# EAGLE design lb_uno_v1.3 (EAGLE 9.6.2)
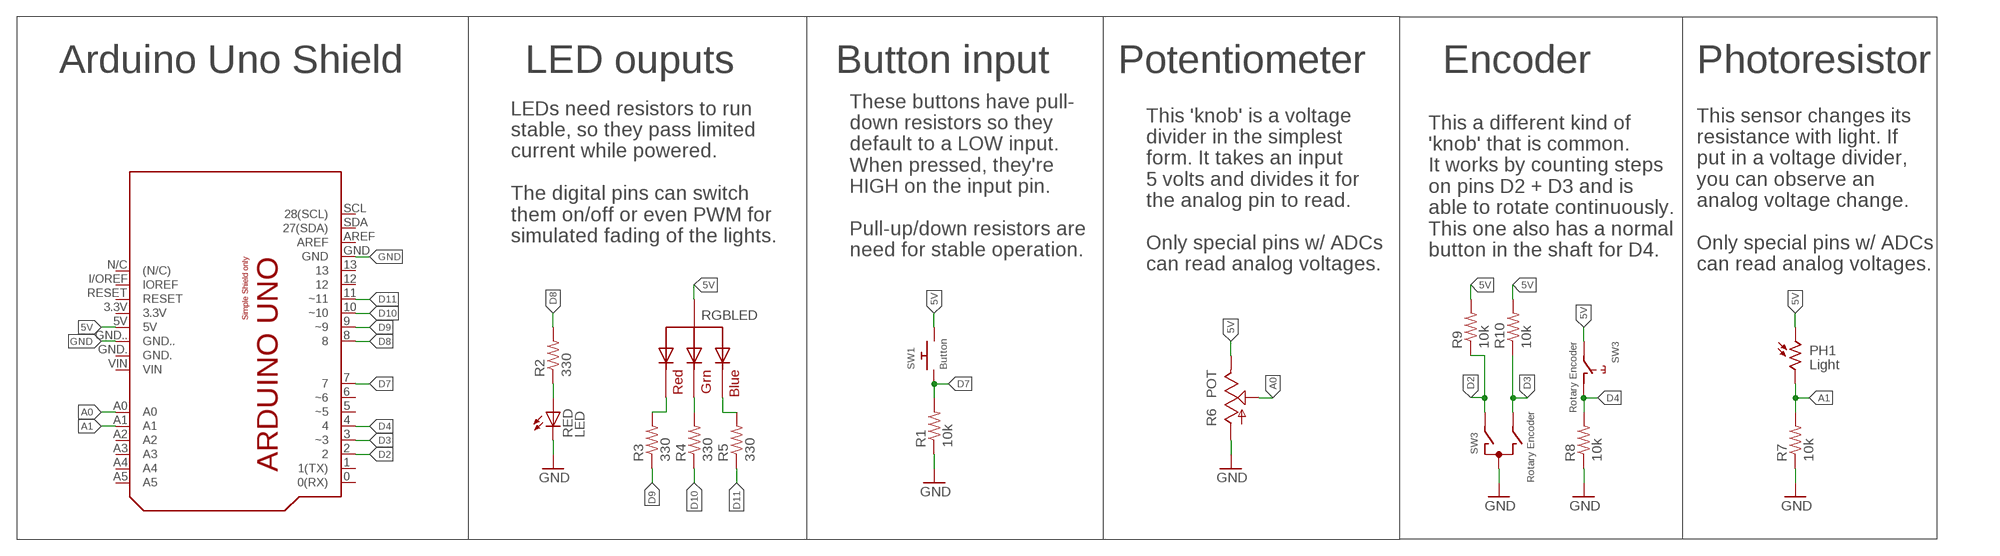
[diagram p0: schematic, sheet 1]

## Parts
PCB1  ARDUINO_UNO_V2  [ARDUINO_UNO_V2]
PH1  Light  A1060_12  [T0-46-A10XX]
R1  10k  R-US_0207/9  [0207/9]
R2  330  R-US_0207/9  [0207/9]
R3  330  R-US_0207/9  [0207/9]
R4  330  R-US_0207/9  [0207/9]
R5  330  R-US_0207/9  [0207/9]
R6  POT  TRIM_US-B25P  [B25P]
R7  10k  R-US_0207/9  [0207/9]
R8  10k  R-US_0207/9  [0207/9]
R9  10k  R-US_0207/9  [0207/9]
R10  10k  R-US_0207/9  [0207/9]
RED  LED  LED5MM  [5MM]
RGBLED  RGBLED  RGBLED_CA-5MM  [LED5MMRGB]
SW1  Button  SWITCH_PUSHBUTTONEVQ-PE  [TACT_PANA-EVQ]
SW3  Rotary Encoder  EC12E_SW  [ALPS_EC12E_SW]

## Nets
5V: PCB1.5V PH1.1 R6.E R9.2 R10.2 RGBLED.2(VCC) SW1.P$2 SW3.E
A0: PCB1.A0 R6.S
A1: PCB1.A1 PH1.2 R7.2
D2: PCB1.2 R9.1 SW3.A
D3: PCB1.3(~3) R10.1 SW3.B
D4: PCB1.4 R8.2 SW3.D
D7: PCB1.7 R1.2 SW1.P$1
D8: PCB1.8 R2.2
D9: PCB1.9(~9) R3.1
D10: PCB1.10(~10) R4.1
D11: PCB1.11(~11) R5.1
GND: PCB1.GND PCB1.GND.. R1.1 R6.A R7.1 R8.1 RED.OUT(C) SW3.C
N$1: R2.1 RED.IN(A)
N$2: R3.2 RGBLED.1(RED)
N$3: R4.2 RGBLED.3(GREEN)
N$4: R5.2 RGBLED.4(BLUE)
Unconnected: PCB1.0(0(RX)) PCB1.1(1(TX)) PCB1.3.3V PCB1.5(~5) PCB1.6(~6) PCB1.12 PCB1.13 PCB1.A2 PCB1.A3 PCB1.A4 PCB1.A5 PCB1.AREF PCB1.GND. PCB1.I/OREF(IOREF) PCB1.N/C((N/C)) PCB1.RESET PCB1.SCL(28(SCL)) PCB1.SDA(27(SDA)) PCB1.VIN SW3.GND1(G) SW3.GND2(G)

## Notes on the sheet
- Arduino Uno Shield | LED ouputs | Button input | Potentiometer | Encoder | Photoresistor
- LEDs need resistors to run
  stable, so they pass limited
  current while powered.
  
  The digital pins can switch
  them on/off or even PWM for
  simulated fading of the lights.
- These buttons have pull-
  down resistors so they 
  default to a LOW input. 
  When pressed, they're 
  HIGH on the input pin.
  
  Pull-up/down resistors are
  need for stable operation.
- This a different kind of
  'knob' that is common. 
  It works by counting steps
  on pins D2 + D3 and is
  able to rotate continuously. 
  This one also has a normal
  button in the shaft for D4.
- This 'knob' is a voltage
  divider in the simplest
  form. It takes an input
  5 volts and divides it for 
  the analog pin to read. 
  
  Only special pins w/ ADCs
  can read analog voltages.
- This sensor changes its 
  resistance with light. If
  put in a voltage divider,
  you can observe an 
  analog voltage change.
  
  Only special pins w/ ADCs
  can read analog voltages.

## Library data of the parts
PCB1 = E14_Arduino_revC:ARDUINO_UNO_V2
PH1 = photo-elements:A10: Sensor Robust Light Sensing Applications Outdoor Light Sensing Application Source: http://optoelectronics.perkinelmer.com/content/Datasheets/DTS_PhotocellsA1050.pdf
R1-R5 R7-R10 = adafruit:R-US_: RESISTOR, American symbol
R6 = pot:TRIM_US-: POTENTIOMETER
RED = fab:LED: LED
RGBLED = adafruit:RGBLED_CA: RGB LED, common-anode 5MM Staggered pins 5mm Piranha package http://www.ladyada.net/library/pcb/eaglelibrary.html
SW1 = adafruit:SWITCH_PUSHBUTTON: Buttons SOFTTOUCHSMD_SJ - Soft touch temporary push button (Super Junk Akihabara) Compatible with SKPMANE010 [Mouser: 688-SKPMAN] C&K_KSS = Digikey: KSS221GLFS
SW3 = switch-alps:EC12E_SW: ALPS rotary Encoder EC12E series with switch; MPN: EC12E2424407; OC_FARNELL: 1520813; OC_NEWARK: 74M1068

## Board
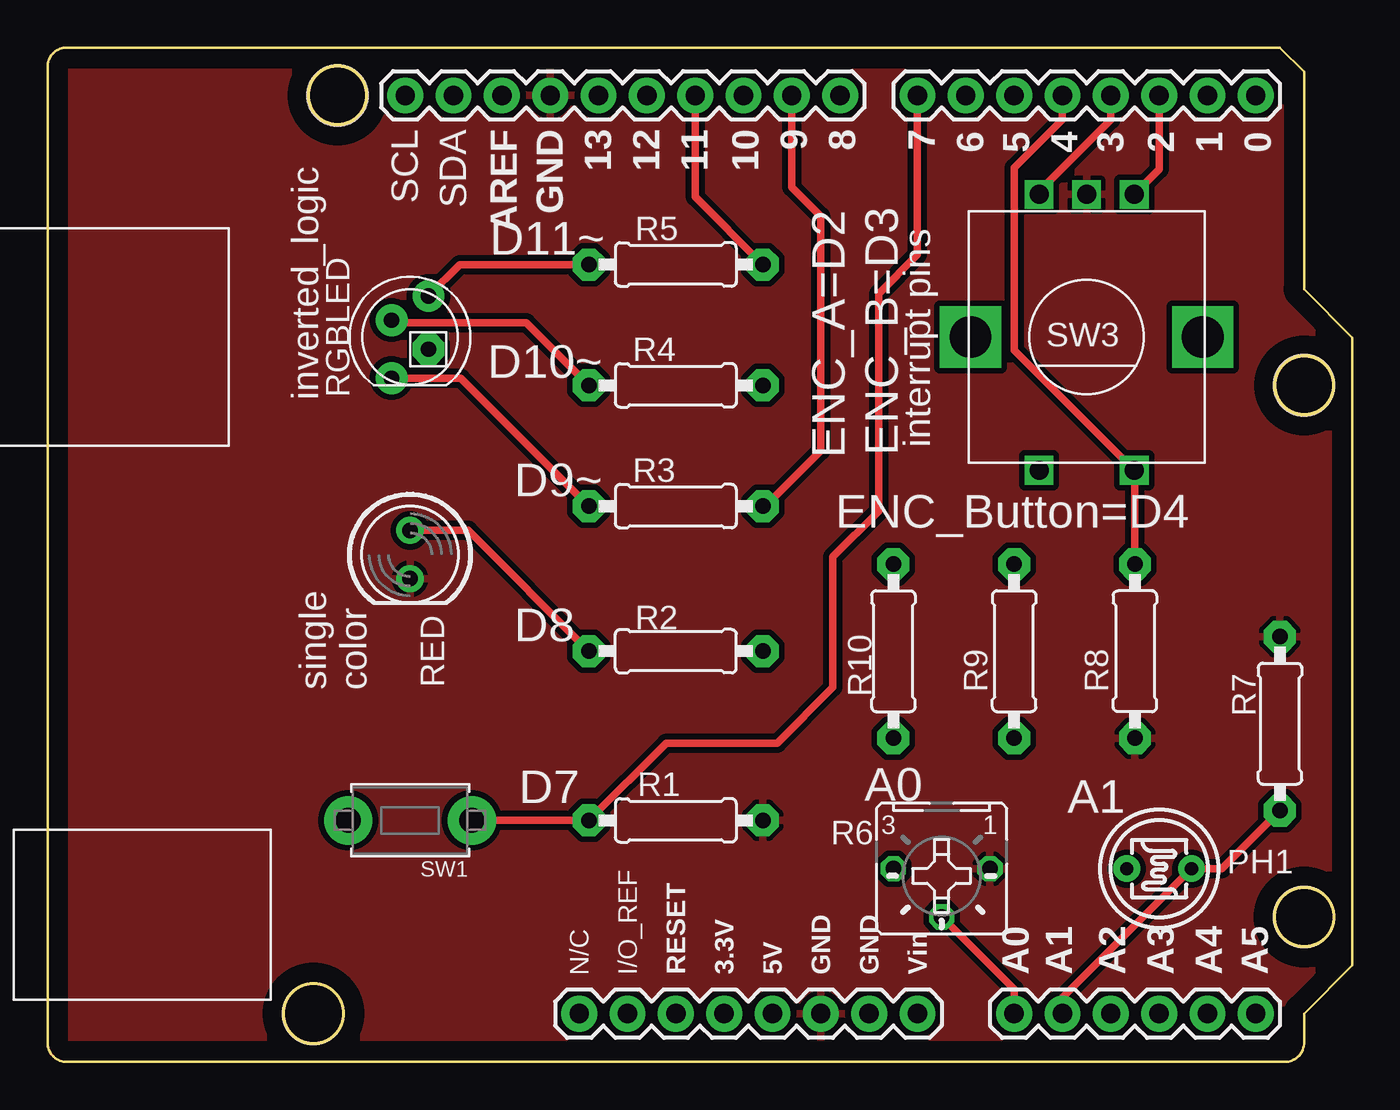
[diagram p1: board, top side]
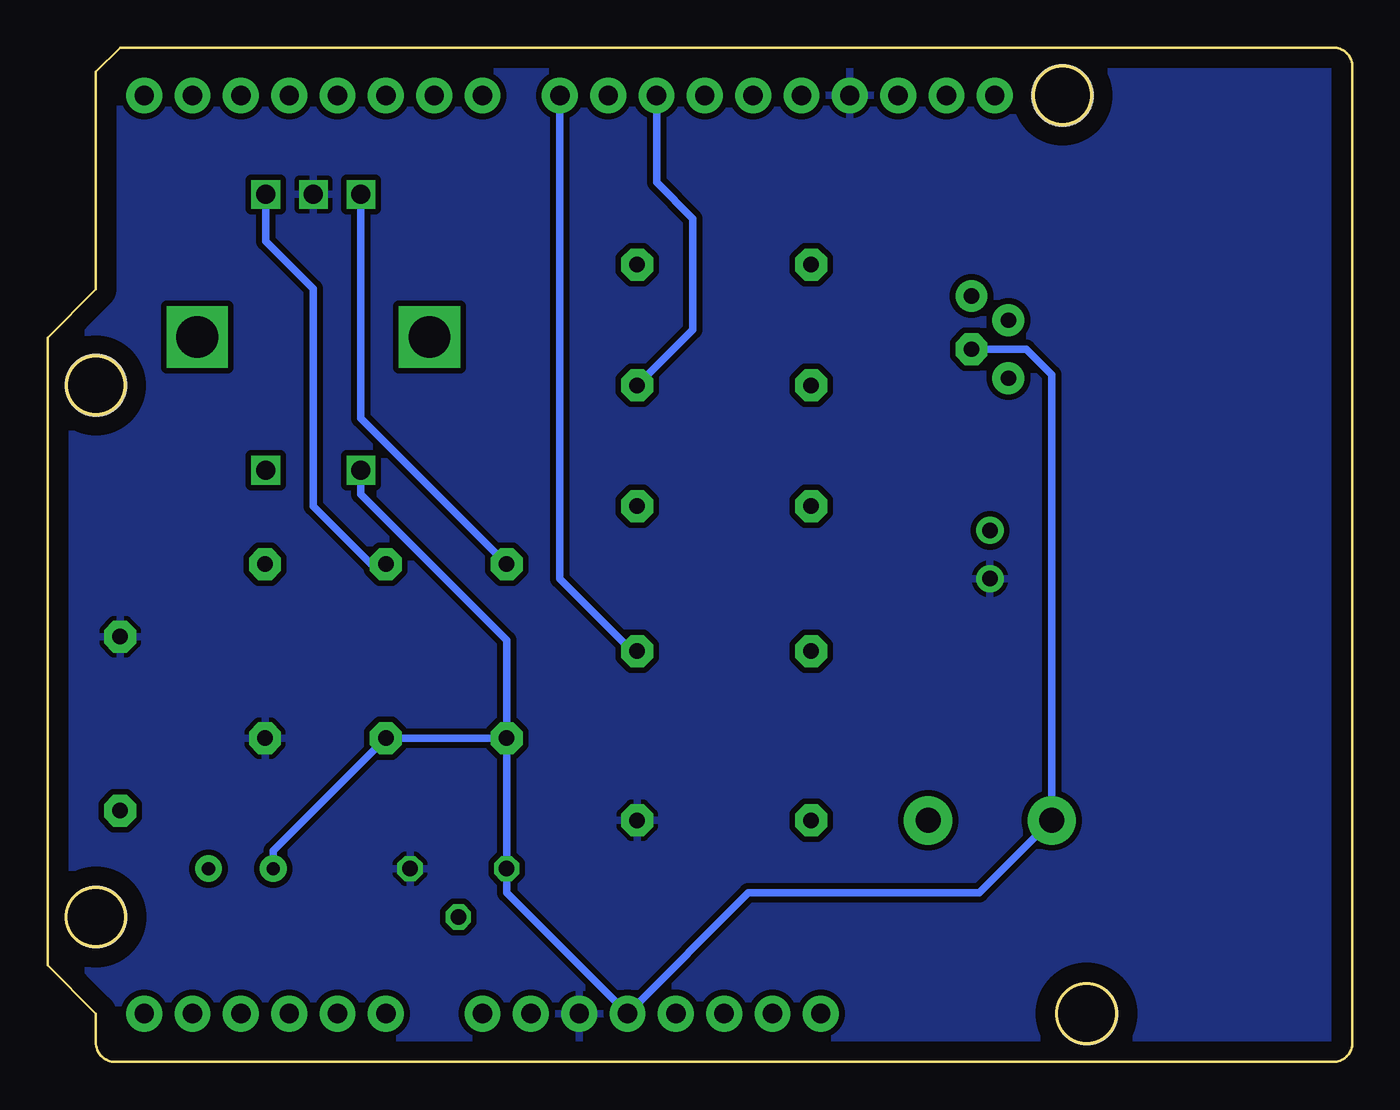
[diagram p2: board, bottom side, seen from below]

Size 68.58 x 53.31 mm. Coordinates in mm from the lower left corner, seen from the top.
Copper layers (1*16): Top 0.035mm / dielectric 1.5mm / Bottom 0.035mm
Design rules "default *": minimum track width 6mil, minimum drill 0.35mm, track to track 12mil, track to pad 12mil, pad to pad 12mil, via to via 12mil, smd to smd 6mil, copper to edge 40mil, drill to drill 6mil, minimum pad ring 10mil, minimum via ring 8mil, stop-mask expansion 4mil, vias tented up to drill 0mil, thermal gap 10mil

### Footprints (pad centres in the part's own frame; a part is rotated, then mirrored left to right if it is on the bottom)
ARDUINO_UNO_V2 = drill 1.016 pad 1.88: 0 63.5,50.8; 1 60.96,50.8; 2 58.42,50.8; 3 55.88,50.8; 3.3V 35.56,2.54; 4 53.34,50.8; 5 50.8,50.8; 5V 38.1,2.54; 6 48.26,50.8; 7 45.72,50.8; 8 41.656,50.8; 9 39.116,50.8; 10 36.576,50.8; 11 34.036,50.8; 12 31.496,50.8; 13 28.956,50.8; A0 50.8,2.54; A1 53.34,2.54; A2 55.88,2.54; A3 58.42,2.54; A4 60.96,2.54; A5 63.5,2.54; AREF 23.876,50.8; GND 26.416,50.8; GND. 43.18,2.54; GND.. 40.64,2.54; I/OREF 30.48,2.54; N/C 27.94,2.54; RESET 33.02,2.54; SCL 18.796,50.8; SDA 21.336,50.8; VIN 45.72,2.54 | hole 3.2: 66.04,7.62; 66.04,35.56; 15.24,50.8; 13.97,2.54
T0-46-A10XX = drill 0.7 pad 1.4: 1 -1.7,0; 2 1.7,0
0207/9 = drill 0.813 pad 1.676 octagon: 1 -4.572,0; 2 4.572,0
B25P = drill 0.813 octagon: A -2.54,0; E 2.54,0; S 0,2.54
5MM = drill 0.813 pad 1.422: IN -1.27,0; OUT 1.27,0
LED5MMRGB = drill 0.8 pad 1.676: 1 -2.159,0.968; 3 0.889,0.968; 4 2.159,-0.968 | drill 0.8 pad 1.676 octagon: 2 -0.635,-0.968
TACT_PANA-EVQ = drill 1.3 pad 2.54: P$1 -3.25,0; P$2 3.25,0
ALPS_EC12E_SW = drill 1 square: A -2.5,-7.5; B 2.5,-7.5; C 0,-7.5; D -2.5,7; E 2.5,7 | drill 2.2 square: GND1 -6.1,0; GND2 6.1,0

### Placement (x,y rotation side)
PCB1  0,0 0 top
PH1  58.42,10.16 0 top
R1  33.02,12.7 180 top
R2  33.02,21.59 0 top
R3  33.02,29.21 180 top
R4  33.02,35.56 180 top
R5  33.02,41.91 180 top
R6  46.99,10.16 180 top
R7  64.77,17.78 270 top
R8  57.15,21.59 90 top
R9  50.8,21.59 270 top
R10  44.45,21.59 270 top
RED  19.05,26.67 270 top
RGBLED  19.05,38.1 90 top
SW1  19.05,12.7 180 top
SW3  54.61,38.1 180 top

### Tracks (layer width: path | path; a pad name or v marks a point on that pad's centre or on a via)
5V
  Bottom 0.406: RGBLED.2 17.14,37.46 15.8,36.12 SW1.P$2 19.61,8.89 31.75,8.89 PCB1.5V 44.45,8.89 R6.E R10.2 | R10.2 R9.2 56.72,11.1 PH1.1 | R10.2 44.45,22.17 52.11,29.83 SW3.E
A0
  Top 0.406: R6.S 50.8,3.81 PCB1.A0
A1
  Top 0.406: R7.2 61.72,10.16 PH1.2 53.34,3.38 PCB1.A1
D2
  Top 0.406: SW3.A 58.42,46.91 PCB1.2
  Bottom 0.406: R9.1 51.56,26.16 54.61,29.21 54.61,40.64 57.11,43.14 SW3.A
D3
  Top 0.406: PCB1.3 55.88,49.53 52.11,45.76 SW3.B
  Bottom 0.406: SW3.B 52.11,33.82 R10.1
D4
  Top 0.406: PCB1.4 53.34,49.53 50.8,46.99 50.8,37.41 SW3.D 57.15,31.06 R8.2
D7
  Top 0.406: SW1.P$1 R1.2 32.51,16.76 38.35,16.76 41.27,19.68 41.27,26.54 43.69,28.96 43.69,40.39 45.72,42.42 PCB1.7
D8
  Bottom 0.406: PCB1.8 41.66,25.4 37.85,21.59 R2.2
D9
  Top 0.406: R3.1 37.72,29.21 40.64,32.13 40.64,44.45 39.12,45.97 PCB1.9
D10
  Bottom 0.406: PCB1.10 36.58,46.23 34.67,44.32 34.67,38.48 R4.1
D11
  Top 0.406: R5.1 34.04,45.47 PCB1.11
GND
  pour Bottom: 0,53.85 68.96,53.85 69.85,52.96 69.85,2.54 67.31,0 0,0
  pour Top: 0,54.99 70.36,54.99 70.36,0 -0.13,0
N$1
  Top 0.406: R2.1 22.1,27.94 RED.IN
N$2
  Top 0.406: RGBLED.1 21.72,35.94 R3.2
N$3
  Top 0.406: RGBLED.3 18.21,38.86 25.15,38.86 R4.2
N$4
  Top 0.406: R5.2 21.67,41.91 RGBLED.4

### Text on the board
tPlace: interrupt pins | D11~ | D10~ | inverted_logic | ENC_A=D2 | ENC_B=D3 | D9~ | ENC_Button=D4 | D8 | single / color | D7 | A0 | A1
tValues: + | V1.3 Deigned by Corey Rice 7/2020 | Soldering: Inputs and Outputs
bValues: https://github.com/crice009/Arduino_Learning_Board | Rotary encoder on digital pins 2 & 3, / which are also interrupt pins (bonus / feature). The encoder also has a / button integrated in the shaft - on / pin 4. Simple LED on pin 8 (not / hardware PWM). The RGB led is on / pins 9, 10, 11 (all PWM enabled) / and colors probably in order: 9-red, / 10-green, 11-blue. Button on pin 7. / *All buttons are logic HIGH when / pressed. / / Potentiomer (pot) on pin A0. / Photoresistor & voltage divider on / pin A1. / Also: try analogRead(A2) for fun ;) | Made for Foundations of Fabrication / at MakeHaven in New Haven, CT, USA